# Altium schematic sheet wave.SchDoc
size A4
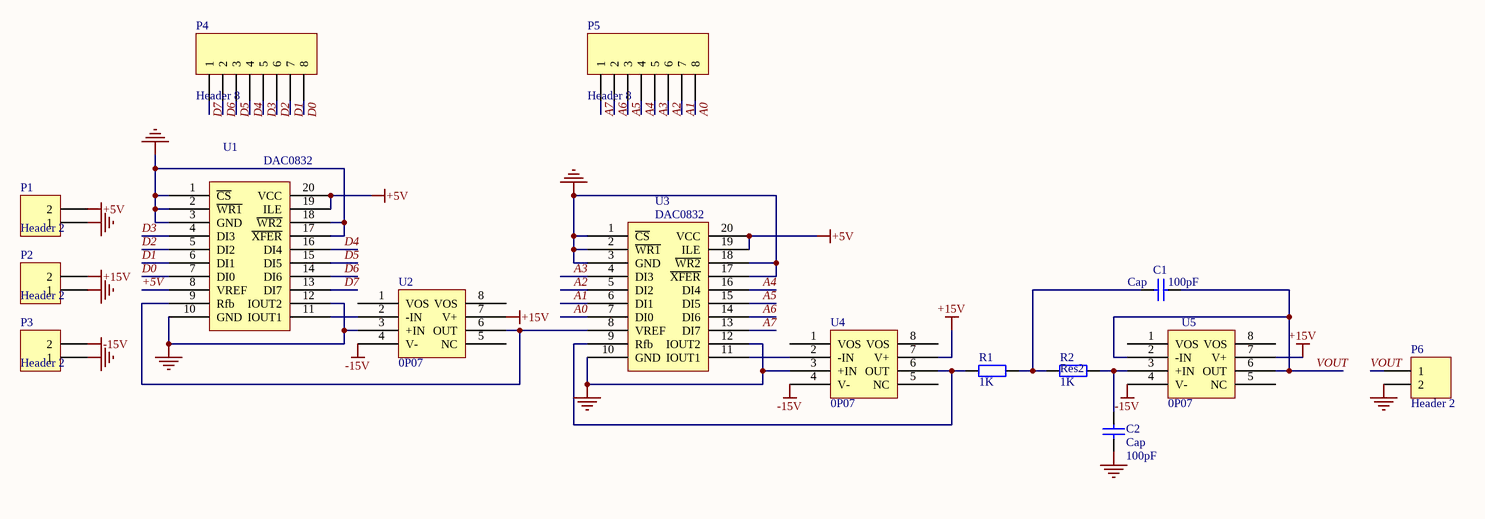
[diagram p0: wave.SchDoc]

## Parts
C1  Cap  value 100pF  [RAD-0.3]
C2  Cap  value 100pF  [RAD-0.3]
P1  Header 2  [HDR1X2]
P2  Header 2  [HDR1X2]
P3  Header 2  [HDR1X2]
P4  Header 8  [HDR1X8]
P5  Header 8  [HDR1X8]
P6  Header 2  [HDR1X2]
R1  value 1K  [AXIAL-0.4]  (hidden comment: Res2)
R2  Res2  value 1K  [AXIAL-0.4]
U1  DAC0832  [DIP-20]
U2  0P07  [DIP-8]
U3  DAC0832  [DIP-20]
U4  0P07  [DIP-8]
U5  0P07  [DIP-8]

## Nets
+5V: P1.2 U1.8(VREF) U1.19(ILE) U1.20(VCC) U3.19(ILE) U3.20(VCC)
+15V: P2.2 U2.7(V+) U4.7(V+) U5.7(V+)
-15V: P3.2 U2.4(V-) U4.4(V-) U5.4(V-)
GND: C2.2 P1.1 P2.1 P3.1 P6.2 U1.1(~{CS}) U1.2(~{WR1}) U1.3(GND) U1.10(GND) U1.12(IOUT2) U1.17(~{XFER}) U1.18(~{WR2}) U2.3(+IN) U3.1(~{CS}) U3.2(~{WR1}) U3.3(GND) U3.10(GND) U3.12(IOUT2) U3.17(~{XFER}) U3.18(~{WR2}) U4.3(+IN)
A0: P5.8 U3.7(DI0)
A1: P5.7 U3.6(DI1)
A2: P5.6 U3.5(DI2)
A3: P5.5 U3.4(DI3)
A4: P5.4 U3.16(DI4)
A5: P5.3 U3.15(DI5)
A6: P5.2 U3.14(DI6)
A7: P5.1 U3.13(DI7)
D0: P4.8 U1.7(DI0)
D1: P4.7 U1.6(DI1)
D2: P4.6 U1.5(DI2)
D3: P4.5 U1.4(DI3)
D4: P4.4 U1.16(DI4)
D5: P4.3 U1.15(DI5)
D6: P4.2 U1.14(DI6)
D7: P4.1 U1.13(DI7)
VOUT: C1.2 P6.1 U5.2(-IN) U5.6(OUT)
NetC1_1: C1.1 R1.2 R2.1
NetC2_1: C2.1 R2.2 U5.3(+IN)
NetR1_1: R1.1 U3.9(Rfb) U4.6(OUT)
NetU1_9: U1.9(Rfb) U2.6(OUT) U3.8(VREF)
NetU1_11: U1.11(IOUT1) U2.2(-IN)
NetU3_11: U3.11(IOUT1) U4.2(-IN)

Not connected (* = marked no-connect by the designer): U2 1(VOS) 5(NC) 8(VOS); U4 1(VOS) 5(NC) 8(VOS); U5 1(VOS) 5(NC) 8(VOS)

## Library data of the parts
C1 C2 = Cap: Capacitor; Published: 8-Jun-2000; LatestRevisionDate: 17-Jul-2002; LatestRevisionNote: Re-released for DXP Platform.; Publisher: Altium Limited
P1-P3 P6 = Header 2: Header, 2-Pin; LatestRevisionDate: 17-Jul-2002; LatestRevisionNote: Re-released for DXP Platform.; Publisher: Altium Limited
P4 P5 = Header 8: Header, 8-Pin; LatestRevisionDate: 17-Jul-2002; LatestRevisionNote: Re-released for DXP Platform.; Publisher: Altium Limited
R1 R2 = Res2: Resistor; Published: 8-Jun-2000; LatestRevisionDate: 17-Jul-2002; LatestRevisionNote: Re-released for DXP Platform.; Publisher: Altium Limited
U2 U4 U5 = OP07